# Altium schematic sheet mixer.SchDoc
size A4
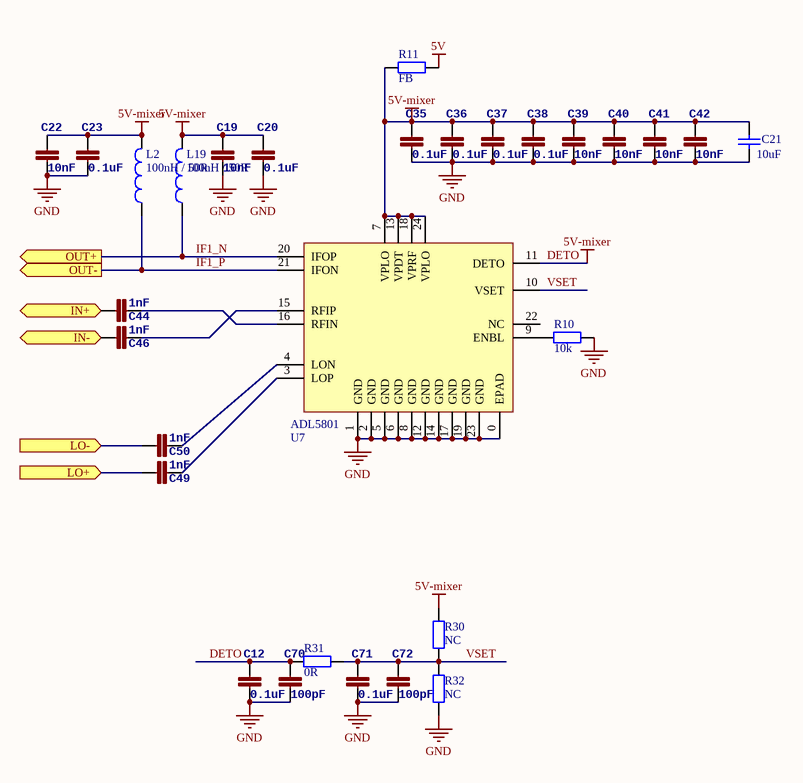
[diagram p0: mixer.SchDoc]

## Parts
C12  0.1uF  [0402]
C19  10nF  [0402]
C20  0.1uF  [0402]
C21  10uF  [0805]
C22  10nF  [0402]
C23  0.1uF  [0402]
C35  0.1uF  [0402]
C36  0.1uF  [0402]
C37  0.1uF  [0402]
C38  0.1uF  [0402]
C39  10nF  [0402]
C40  10nF  [0402]
C41  10nF  [0402]
C42  10nF  [0402]
C44  1nF  [0402]
C46  1nF  [0402]
C49  1nF  [0402]
C50  1nF  [0402]
C70  100pF  [0402]
C71  0.1uF  [0402]
C72  100pF  [0402]
L2  value 100nH / 50R  [0603]  (hidden comment: Inductor)
L19  value 100nH / 50R  [0603]  (hidden comment: Inductor)
R10  value 10k  [0402]  (hidden comment: Res2)
R11  FB  [0603]
R30  value NC  [0402]  (hidden comment: Res2)
R31  value 0R  [0402]  (hidden comment: Res2)
R32  value NC  [0402]  (hidden comment: Res2)
U7  ADL5801  [ADL5801]

## Ports
IN+ (in), IN- (in), LO+ (in), LO- (in), OUT+ (out), OUT- (out)

## Nets
5V: R11.2
DETO: C12.2 C19.2 C20.2 C21.2 C22.2 C23.2 C35.2 C36.2 C37.2 C38.2 C39.2 C40.2 C41.2 C42.2 C70.2 L2.2 L19.2 R11.1 R30.2 R31.1 U7.7(VPLO) U7.11(DETO) U7.13(VPDT) U7.18(VPRF) U7.24(VPLO)  [also labelled 5V-mixer]
GND: C12.1 C19.1 C20.1 C21.1 C22.1 C23.1 C35.1 C36.1 C37.1 C38.1 C39.1 C40.1 C41.1 C42.1 C70.1 C71.1 C72.1 R10.2 R32.1 U7.0(EPAD) U7.1(GND) U7.2(GND) U7.5(GND) U7.6(GND) U7.8(GND) U7.12(GND) U7.14(GND) U7.17(GND) U7.19(GND) U7.23(GND)
IF1_N: L19.1 U7.20(IFOP) ; port OUT+
IF1_P: L2.1 U7.21(IFON) ; port OUT-
IN+: C44.1 ; port IN+
IN-: C46.1 ; port IN-
LO+: C49.1 ; port LO+
LO-: C50.1 ; port LO-
VSET: C71.2 C72.2 R30.1 R31.2 R32.2 U7.10(VSET)
NetC44_2: C44.2 U7.16(RFIN)
NetC46_2: C46.2 U7.15(RFIP)
NetC49_2: C49.2 U7.3(LOP)
NetC50_2: C50.2 U7.4(LON)
NetR10_1: R10.1 U7.9(ENBL)

Not connected (* = marked no-connect by the designer): U7 22(NC)

## Library data of the parts
C12 C19 C20 C22 C23 C35-C42 C44 C46 C49 C50 C70-C72 = CAP0402-CAP: <b>Capacitor</b> / Standard 0603 ceramic capacitor, and 0.1" leaded capacitor.; PARTNO: CC0402ZRY5V7BB104
C21 = Cap: Capacitor; Published: 8-Jun-2000; LatestRevisionDate: 17-Jul-2002; LatestRevisionNote: Re-released for DXP Platform.; PackageReference: RAD-0.3; Publisher: Altium Limited; PackageDescription: Radial Cap, Thru-Hole; 2 Leads; 0.3 in Pin Spacing
L2 L19 = Inductor: Code_IEC: 1005; Published: 8-Jun-2000; LatestRevisionDate: 29-May-2009; LatestRevisionNote: IPC-7351 Footprint Added.; PackageReference: 0402-A; Publisher: Altium Limited; PackageDescription: Chip Inductor; Code_JEITA: 0402
R10 R30-R32 = Res2: Resistor; Published: 8-Jun-2000; LatestRevisionDate: 17-Jul-2002; LatestRevisionNote: Re-released for DXP Platform.; PackageReference: AXIAL-0.4; Publisher: Altium Limited; PackageDescription: Axial Device, Thru-Hole; 2 Leads; 0.4 in Pin Spacing
R11 = Res2: Resistor; Value: 0Ohm; Published: 8-Jun-2000; LatestRevisionDate: 17-Jul-2002; LatestRevisionNote: Re-released for DXP Platform.; PackageReference: AXIAL-0.4; Publisher: Altium Limited; PackageDescription: Axial Device, Thru-Hole; 2 Leads; 0.4 in Pin Spacing